# Altium schematic sheet sheet_to_bcd.SchDoc
size A4
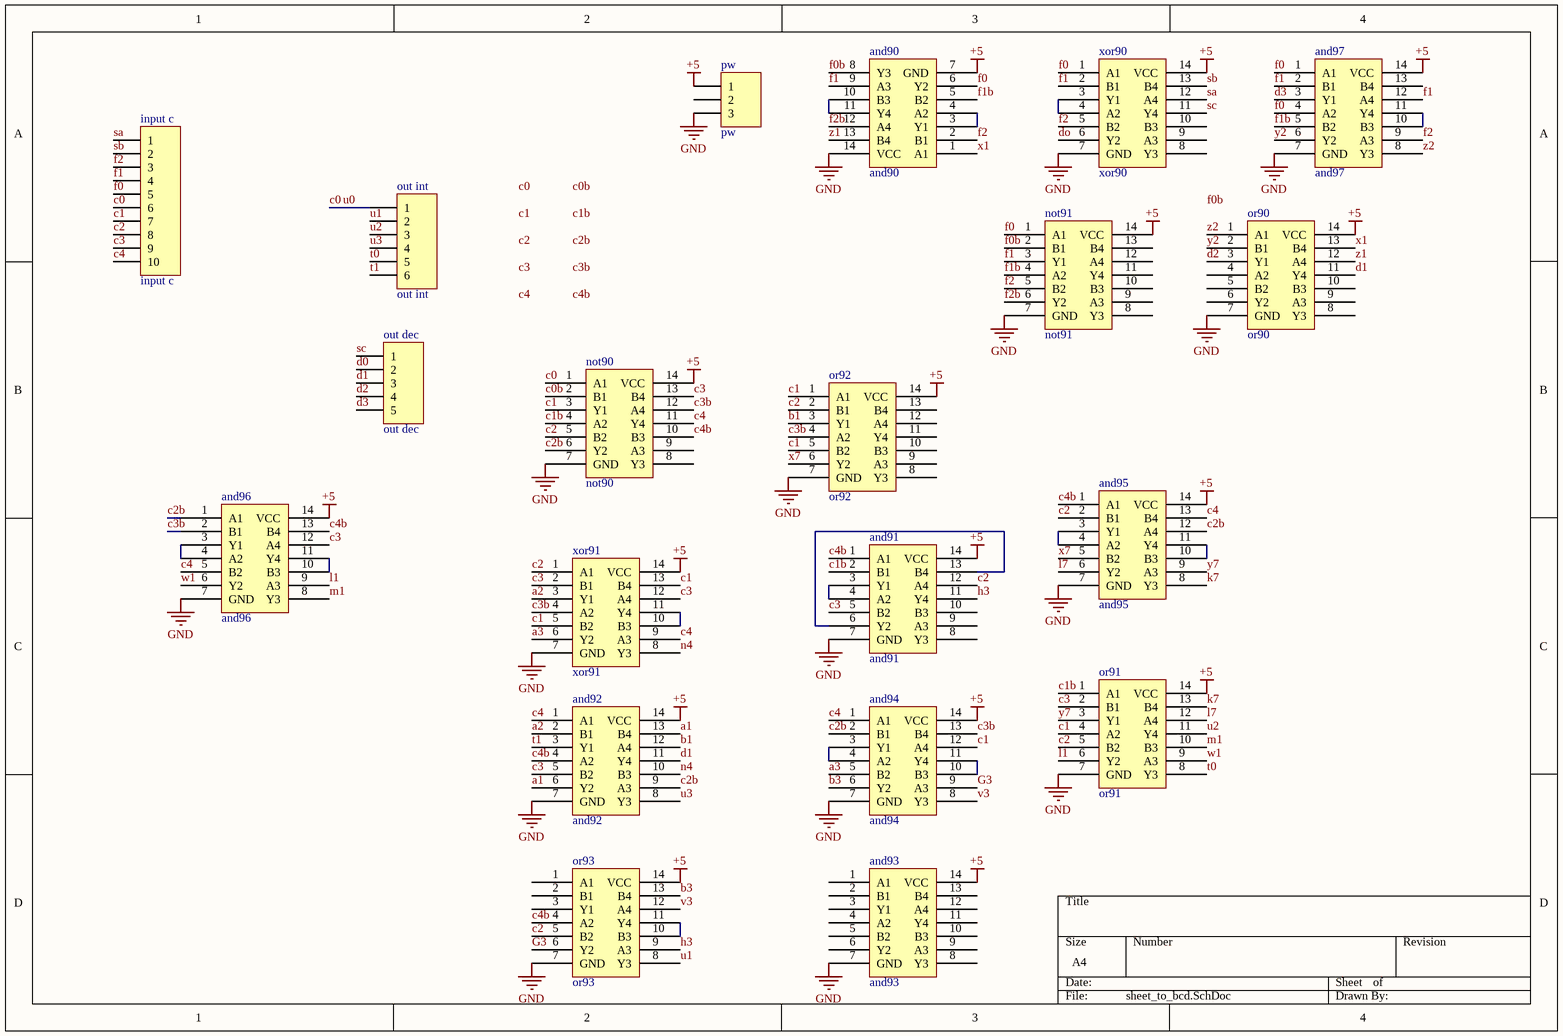
[diagram p0: sheet_to_bcd.SchDoc]

## Parts
and90  and90  [PCBComponent_1]
and91  and91  [PCBComponent_1]
and92  and92  [PCBComponent_1]
and93  and93  [PCBComponent_1]
and94  and94  [PCBComponent_1]
and95  and95  [PCBComponent_1]
and96  and96  [PCBComponent_1]
and97  and97  [PCBComponent_1]
input_c  input c  [HDR1X10H]
not90  not90  [PCBComponent_1]
not91  not91  [PCBComponent_1]
or90  or90  [PCBComponent_1]
or91  or91  [PCBComponent_1]
or92  or92  [PCBComponent_1]
or93  or93  [PCBComponent_1]
out_dec  out dec  [HDR1X5]
out_int  out int  [HDR1X6]
pw  pw  [HDR1X3]
xor90  xor90  [PCBComponent_1]
xor91  xor91  [PCBComponent_1]

## Nets
+5: and90.7(GND) and91.14(VCC) and92.14(VCC) and93.14(VCC) and94.14(VCC) and95.14(VCC) and96.14(VCC) and97.14(VCC) not90.14(VCC) not91.14(VCC) or90.14(VCC) or91.14(VCC) or92.14(VCC) or93.14(VCC) pw.1 xor90.14(VCC) xor91.14(VCC)
GND: and90.14(VCC) and91.7(GND) and92.7(GND) and93.7(GND) and94.7(GND) and95.7(GND) and96.7(GND) and97.7(GND) not90.7(GND) not91.7(GND) or90.7(GND) or91.7(GND) or92.7(GND) or93.7(GND) pw.3 xor90.7(GND) xor91.7(GND)
a1: and92.6(Y2) and92.13(B4)
a2: and92.2(B1) xor91.3(Y1)
a3: and94.5(B2) xor91.6(Y2)
b1: and92.12(A4) or92.3(Y1)
b3: and94.6(Y2) or93.13(B4)
c0: input_c.6 not90.1(A1) out_int.1  [also labelled u0]
c0b: not90.2(B1)
c1: and94.12(A4) input_c.7 not90.3(Y1) or91.4(A2) or92.1(A1) or92.5(B2) xor91.5(B2) xor91.13(B4)
c1b: and91.2(B1) not90.4(A2) or91.1(A1)
c2: and91.12(A4) and95.2(B1) input_c.8 not90.5(B2) or91.5(B2) or92.2(B1) or93.5(B2) xor91.1(A1)
c2b: and92.9(A3) and94.2(B1) and95.12(A4) and96.1(A1) not90.6(Y2)
c3: and91.5(B2) and92.5(B2) and96.12(A4) input_c.9 not90.13(B4) or91.2(B1) xor91.2(B1) xor91.12(A4)
c3b: and94.13(B4) and96.2(B1) not90.12(A4) or92.4(A2) xor91.4(A2)
c4: and92.1(A1) and94.1(A1) and95.13(B4) and96.5(B2) input_c.10 not90.11(Y4) xor91.9(A3)
c4b: and91.1(A1) and92.4(A2) and95.1(A1) and96.13(B4) not90.10(B3) or93.4(A2)
d0: out_dec.2
d1: and92.11(Y4) or90.11(Y4) out_dec.3
d2: or90.3(Y1) out_dec.4
d3: and97.3(Y1) out_dec.5
do: xor90.6(Y2)
f0: and90.6(Y2) and97.1(A1) and97.4(A2) input_c.5 not91.1(A1) xor90.1(A1)
f0b: and90.8(Y3) not91.2(B1)
f1: and90.9(A3) and97.2(B1) and97.12(A4) input_c.4 not91.3(Y1) xor90.2(B1)
f1b: and90.5(B2) and97.5(B2) not91.4(A2)
f2: and90.2(B1) and97.9(A3) input_c.3 not91.5(B2) xor90.5(B2)
f2b: and90.12(A4) not91.6(Y2)
G3: and94.9(A3) or93.6(Y2)
h3: and91.11(Y4) or93.9(A3)
k7: and95.8(Y3) or91.13(B4)
l1: and96.9(A3) or91.6(Y2)
l7: and95.6(Y2) or91.12(A4)
m1: and96.8(Y3) or91.10(B3)
n4: and92.10(B3) xor91.8(Y3)
sa: input_c.1 xor90.12(A4)
sb: input_c.2 xor90.13(B4)
sc: out_dec.1 xor90.11(Y4)
t0: or91.8(Y3) out_int.5
t1: and92.3(Y1) out_int.6
u1: or93.8(Y3) out_int.2
u2: or91.11(Y4) out_int.3
u3: and92.8(Y3) out_int.4
v3: and94.8(Y3) or93.12(A4)
w1: and96.6(Y2) or91.9(A3)
x1: and90.1(A1) or90.13(B4)
x7: and95.5(B2) or92.6(Y2)
y2: and97.6(Y2) or90.2(B1)
y7: and95.9(A3) or91.3(Y1)
z1: and90.13(B4) or90.12(A4)
z2: and97.8(Y3) or90.1(A1)
Netand90_3: and90.3(Y1) and90.4(A2)
Netand90_10: and90.10(B3) and90.11(Y4)
Netand91_3: and91.3(Y1) and91.4(A2)
Netand91_6: and91.6(Y2) and91.13(B4)
Netand94_3: and94.3(Y1) and94.4(A2)
Netand94_10: and94.10(B3) and94.11(Y4)
Netand95_3: and95.3(Y1) and95.4(A2)
Netand95_10: and95.10(B3) and95.11(Y4)
Netand96_3: and96.3(Y1) and96.4(A2)
Netand96_10: and96.10(B3) and96.11(Y4)
Netand97_10: and97.10(B3) and97.11(Y4)
Netor93_10: or93.10(B3) or93.11(Y4)
Netxor90_3: xor90.3(Y1) xor90.4(A2)
Netxor91_10: xor91.10(B3) xor91.11(Y4)

Not connected (* = marked no-connect by the designer): and91 8(Y3) 9(A3) 10(B3); and93 1(A1) 2(B1) 3(Y1) 4(A2) 5(B2) 6(Y2) 8(Y3) 9(A3) 10(B3) 11(Y4) 12(A4) 13(B4); and97 13(B4); not90 8(Y3) 9(A3); not91 8(Y3) 9(A3) 10(B3) 11(Y4) 12(A4) 13(B4); or90 4(A2) 5(B2) 6(Y2) 8(Y3) 9(A3) 10(B3); or92 8(Y3) 9(A3) 10(B3) 11(Y4) 12(A4) 13(B4); or93 1(A1) 2(B1) 3(Y1); pw 2; xor90 8(Y3) 9(A3) 10(B3)

## Notes on the sheet
- Labels drawn without touching a wire or pin: c0, c0b, c1, c1b, c2, c2b, c3, c3b, c4, c4b, f0b

## Library data of the parts
and90-and97 not90 not91 or90-or93 xor90 xor91 = Component_1
input_c = Header 10H: Header, 10-Pin, Right Angle; LatestRevisionDate: 17-Jul-2002; LatestRevisionNote: Re-released for DXP Platform.; Publisher: Altium Limited
out_dec = Header 5: Header, 5-Pin; LatestRevisionDate: 17-Jul-2002; LatestRevisionNote: Re-released for DXP Platform.; Publisher: Altium Limited
out_int = Header 6: Header, 6-Pin; LatestRevisionDate: 17-Jul-2002; LatestRevisionNote: Re-released for DXP Platform.; Publisher: Altium Limited
pw = Header 3: Header, 3-Pin; LatestRevisionDate: 17-Jul-2002; LatestRevisionNote: Re-released for DXP Platform.; Publisher: Altium Limited